# EAGLE design leddriver (EAGLE 9.3.0)
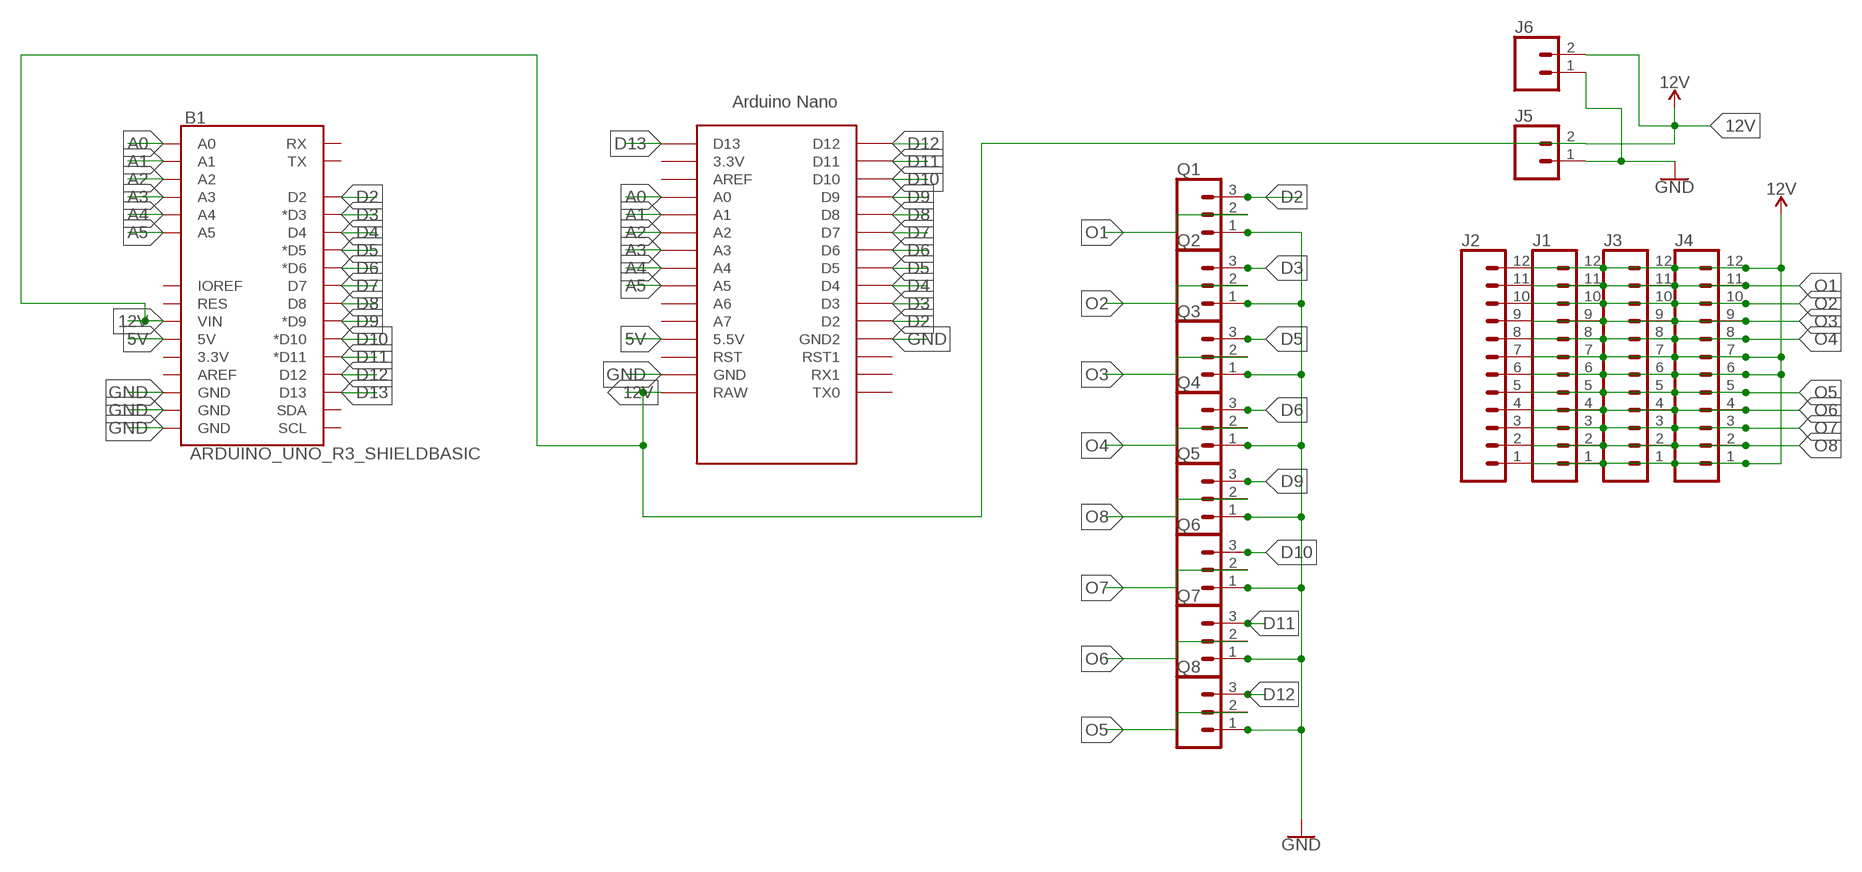
[diagram p0: schematic, sheet 1]

## Parts
B1  ARDUINO_UNO_R3_SHIELDBASIC  [UNO_R3_SHIELD]
J1  CONN_12  [1X12]
J2  CONN_12  [1X12]
J3  CONN_12  [1X12]
J4  CONN_12  [1X12]
J5  CONN_02  [1X02]
J6  CONN_02  [1X02]
Q1  455-1750-1-ND  CONN_03  [1X03]
Q2  455-1750-1-ND  CONN_03  [1X03]
Q3  455-1750-1-ND  CONN_03  [1X03]
Q4  455-1750-1-ND  CONN_03  [1X03]
Q5  455-1750-1-ND  CONN_03  [1X03]
Q6  455-1750-1-ND  CONN_03  [1X03]
Q7  455-1750-1-ND  CONN_03  [1X03]
Q8  455-1750-1-ND  CONN_03  [1X03]
U$1  NANO  [NANO]

## Nets
5V: B1.5V U$1.5V(5.5V)
12V: B1.VIN J1.1 J1.6 J1.7 J1.12 J2.1 J2.6 J2.7 J2.12 J3.1 J3.6 J3.7 J3.12 J4.1 J4.6 J4.7 J4.12 J5.2 J6.2 U$1.RAW
A0: B1.A0 U$1.A0
A1: B1.A1 U$1.A1
A2: B1.A2 U$1.A2
A3: B1.A3 U$1.A3
A4: B1.A4 U$1.A4
A5: B1.A5 U$1.A5
D2: B1.D2 Q1.3 U$1.D2
D3: B1.D3(*D3) Q2.3 U$1.D3
D4: B1.D4 U$1.D4
D5: B1.D5(*D5) Q3.3 U$1.D5
D6: B1.D6(*D6) Q4.3 U$1.D6
D7: B1.D7 U$1.D7
D8: B1.D8 U$1.D8
D9: B1.D9(*D9) Q5.3 U$1.D9
D10: B1.D10(*D10) Q6.3 U$1.D10
D11: B1.D11(*D11) Q7.3 U$1.D11
D12: B1.D12 Q8.3 U$1.D12
D13: B1.D13 U$1.D13
GND: B1.GND@0(GND) B1.GND@1(GND) B1.GND@2(GND) J5.1 J6.1 Q1.1 Q2.1 Q3.1 Q4.1 Q5.1 Q6.1 Q7.1 Q8.1 U$1.GND U$1.GND1(GND2)
O1: J1.11 J2.11 J3.11 J4.11 Q1.2
O2: J1.10 J2.10 J3.10 J4.10 Q2.2
O3: J1.9 J2.9 J3.9 J4.9 Q3.2
O4: J1.8 J2.8 J3.8 J4.8 Q4.2
O5: J1.5 J2.5 J3.5 J4.5 Q8.2
O6: J1.4 J2.4 J3.4 J4.4 Q7.2
O7: J1.3 J2.3 J3.3 J4.3 Q6.2
O8: J1.2 J2.2 J3.2 J4.2 Q5.2
Unconnected: B1.3.3V B1.AREF B1.IOREF B1.RES B1.RX B1.SCL B1.SDA B1.TX U$1.3.3V U$1.A6 U$1.A7 U$1.AREF U$1.ICSP1 U$1.ICSP2 U$1.ICSP3 U$1.ICSP4 U$1.ICSP5 U$1.ICSP6 U$1.RST U$1.RST1 U$1.RX1 U$1.TX0

## Library data of the parts
B1 = SparkFun-Boards:ARDUINO_UNO_R3_SHIELD: Arduino R3 Shield Footprint Shield form compatible with the Arduino Uno R3. SparkFun Products: MG2639 Cellular Shield <https://www.sparkfun.com/products/13120> MIDI Shield <https://www.sparkfun.com/products/12898> R3 Stackable Headers Kit <https://www.sparkfun.com/products/11417>
J1-J4 = SparkFun-Connectors:CONN_12: Multi connection point. Often used as Generic Header-pin footprint for 0.1 inch spaced/style header connections On any of the 0.1 inch spaced packages, you can populate with these: Break Away Headers - Straight <https://www.sparkfun.com/products/116> (PRT-00116) Break Away Male Headers - Right Angle <https://www.sparkfun.com/products/553> (PRT-00553) Female Headers <https://www.sparkfun.com/products/115> (PRT-00115) Break Away Headers - Machine Pin <https://www.sparkfun.com/products/117> (PRT-00117) Break Away Female Headers - Swiss Machine Pin <https://www.sparkfun.com/products/743> (PRT-00743) For SCREWTERMINALS and SPRING TERMINALS visit here: Screw Terimnals on SparkFun.com <https://www.sparkfun.com/search/results?term=Screw+Terminals> (5mm/3.5mm/2.54mm spacing) This device is also useful as a general connection point to wire up your design to another part of your project. Our various solder wires solder well into these plated through hole pads. Hook-Up Wire - Assortment (Stranded, 22 AWG) <https://www.sparkfun.com/products/11375> (PRT-11375) Hook-Up Wire - Assortment (Solid Core, 22 AWG) <https://www.sparkfun.com/products/11367> (PRT-11367) View the entire wire category on our website here <https://www.sparkfun.com/categories/141> Special notes: Molex polarized connector foot print use with SKU : PRT-08231 with associated crimp pins and housings. 1MM SMD Version SKU: PRT-10208 NOTES ON THE VARIANTS LOCK and LOCK_LONGPADS... This footprint was designed to help hold the alignment of a through-hole component (i.e. 6-pin header) while soldering it into place. You may notice that each hole has been shifted either up or down by 0.005 of an inch from it's more standard position (which is a perfectly straight line). This slight alteration caused the pins (the squares in the middle) to touch the edges of the holes. Because they are alternating, it causes a "brace" to hold the component in place. 0.005 has proven to be the perfect amount of "off-center" position when using our standard breakaway headers. Although looks a little odd when you look at the bare footprint, once you have a header in there, the alteration is very hard to notice. Also,if you push a header all the way into place, it is covered up entirely on the bottom side.
J5 J6 = SparkFun-Connectors:CONN_02: Multi connection point. Often used as Generic Header-pin footprint for 0.1 inch spaced/style header connections On any of the 0.1 inch spaced packages, you can populate with these: Break Away Headers - Straight <https://www.sparkfun.com/products/116> (PRT-00116) Break Away Male Headers - Right Angle <https://www.sparkfun.com/products/553> (PRT-00553) Female Headers <https://www.sparkfun.com/products/115> (PRT-00115) Break Away Headers - Machine Pin <https://www.sparkfun.com/products/117> (PRT-00117) Break Away Female Headers - Swiss Machine Pin <https://www.sparkfun.com/products/743> (PRT-00743) For SCREWTERMINALS and SPRING TERMINALS visit here: Screw Terimnals on SparkFun.com <https://www.sparkfun.com/search/results?term=Screw+Terminals> (5mm/3.5mm/2.54mm spacing) This device is also useful as a general connection point to wire up your design to another part of your project. Our various solder wires solder well into these plated through hole pads. Hook-Up Wire - Assortment (Stranded, 22 AWG) <https://www.sparkfun.com/products/11375> (PRT-11375) Hook-Up Wire - Assortment (Solid Core, 22 AWG) <https://www.sparkfun.com/products/11367> (PRT-11367) View the entire wire category on our website here <https://www.sparkfun.com/categories/141> Special notes: Molex polarized connector foot print use with: PRT-08233 with associated crimp pins and housings. 2.54_SCREWTERM for use with PRT-10571. 3.5mm Screw Terminal footprints for PRT-08084 5mm Screw Terminal footprints for use with PRT-08432
Q1-Q8 = SparkFun-Connectors:CONN_03: Multi connection point. Often used as Generic Header-pin footprint for 0.1 inch spaced/style header connections On any of the 0.1 inch spaced packages, you can populate with these: Break Away Headers - Straight <https://www.sparkfun.com/products/116> (PRT-00116) Break Away Male Headers - Right Angle <https://www.sparkfun.com/products/553> (PRT-00553) Female Headers <https://www.sparkfun.com/products/115> (PRT-00115) Break Away Headers - Machine Pin <https://www.sparkfun.com/products/117> (PRT-00117) Break Away Female Headers - Swiss Machine Pin <https://www.sparkfun.com/products/743> (PRT-00743) Stackable Header - 3 Pin (Female, 0.1") <https://www.sparkfun.com/products/13875> (PRT-13875) For SCREWTERMINALS and SPRING TERMINALS visit here: Screw Terimnals on SparkFun.com <https://www.sparkfun.com/search/results?term=Screw+Terminals> (5mm/3.5mm/2.54mm spacing) This device is also useful as a general connection point to wire up your design to another part of your project. Our various solder wires solder well into these plated through hole pads. Hook-Up Wire - Assortment (Stranded, 22 AWG) <https://www.sparkfun.com/products/11375> (PRT-11375) Hook-Up Wire - Assortment (Solid Core, 22 AWG) <https://www.sparkfun.com/products/11367> (PRT-11367) View the entire wire category on our website here <https://www.sparkfun.com/categories/141> Special notes: Molex polarized connector foot print use with SKU : PRT-08232 with associated crimp pins and housings.; PROD_ID: XXX-00000
U$1 = Arduino-clone:NANO: Arduino Nano

## Board
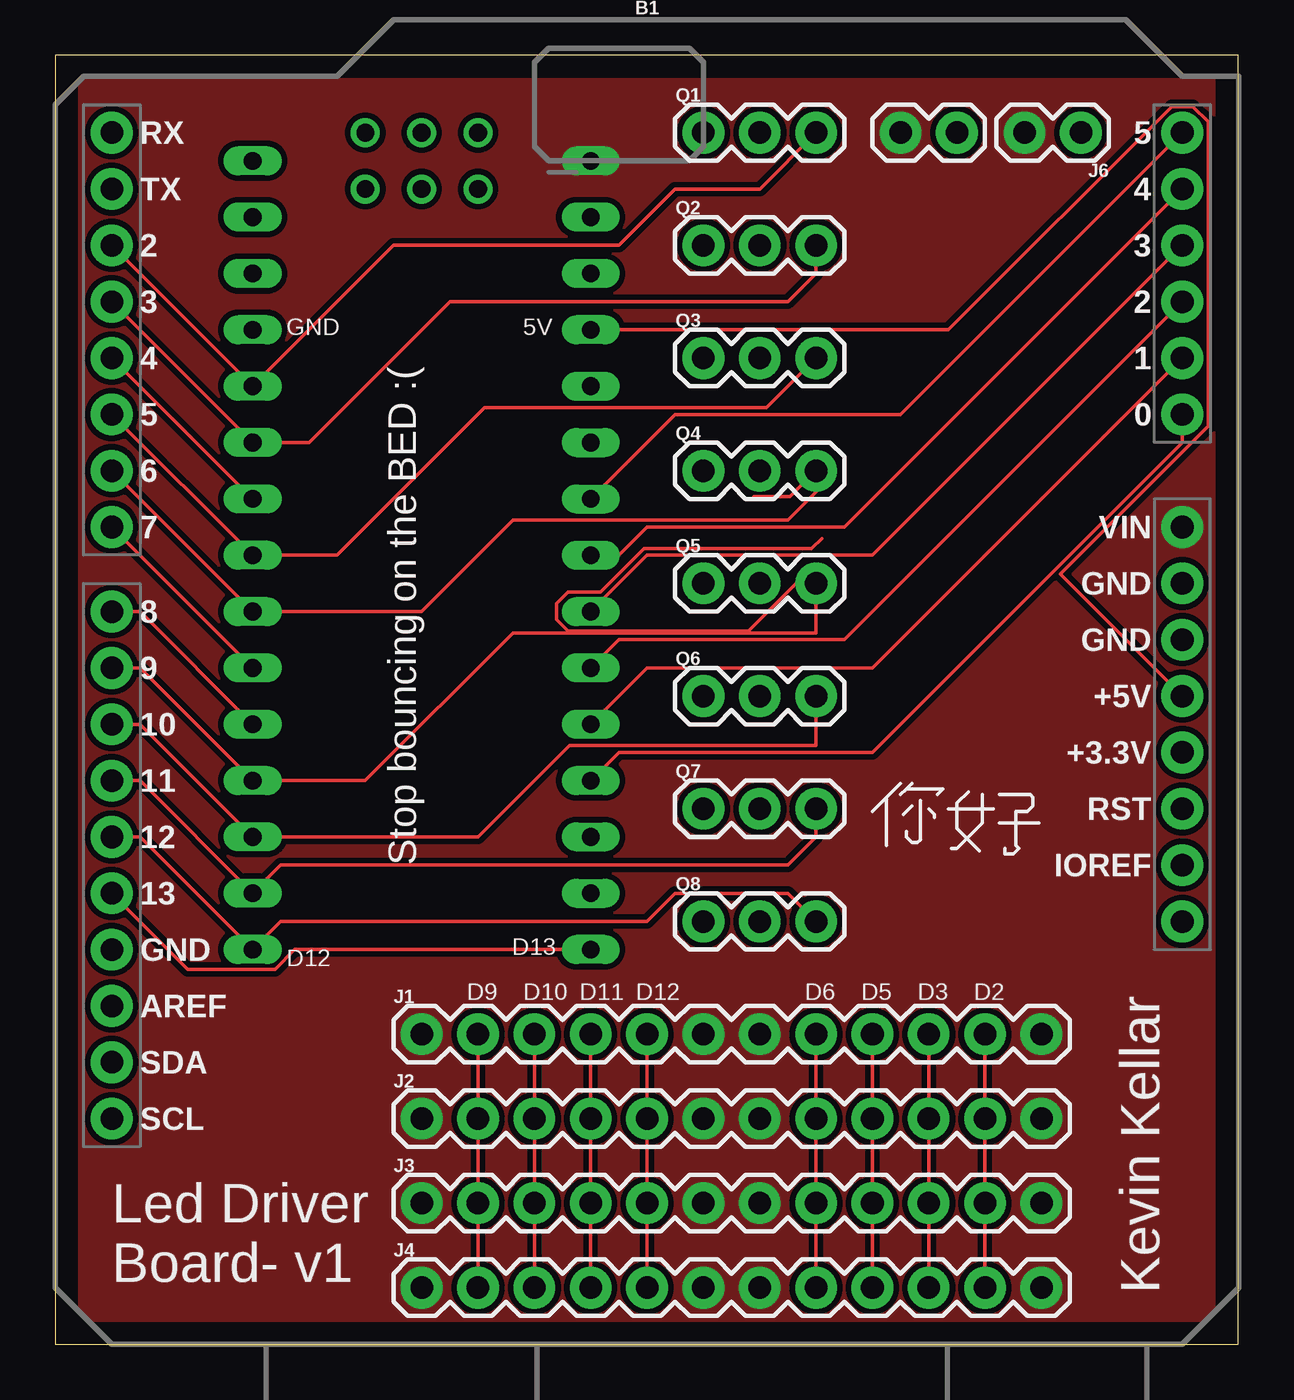
[diagram p1: board, top side]
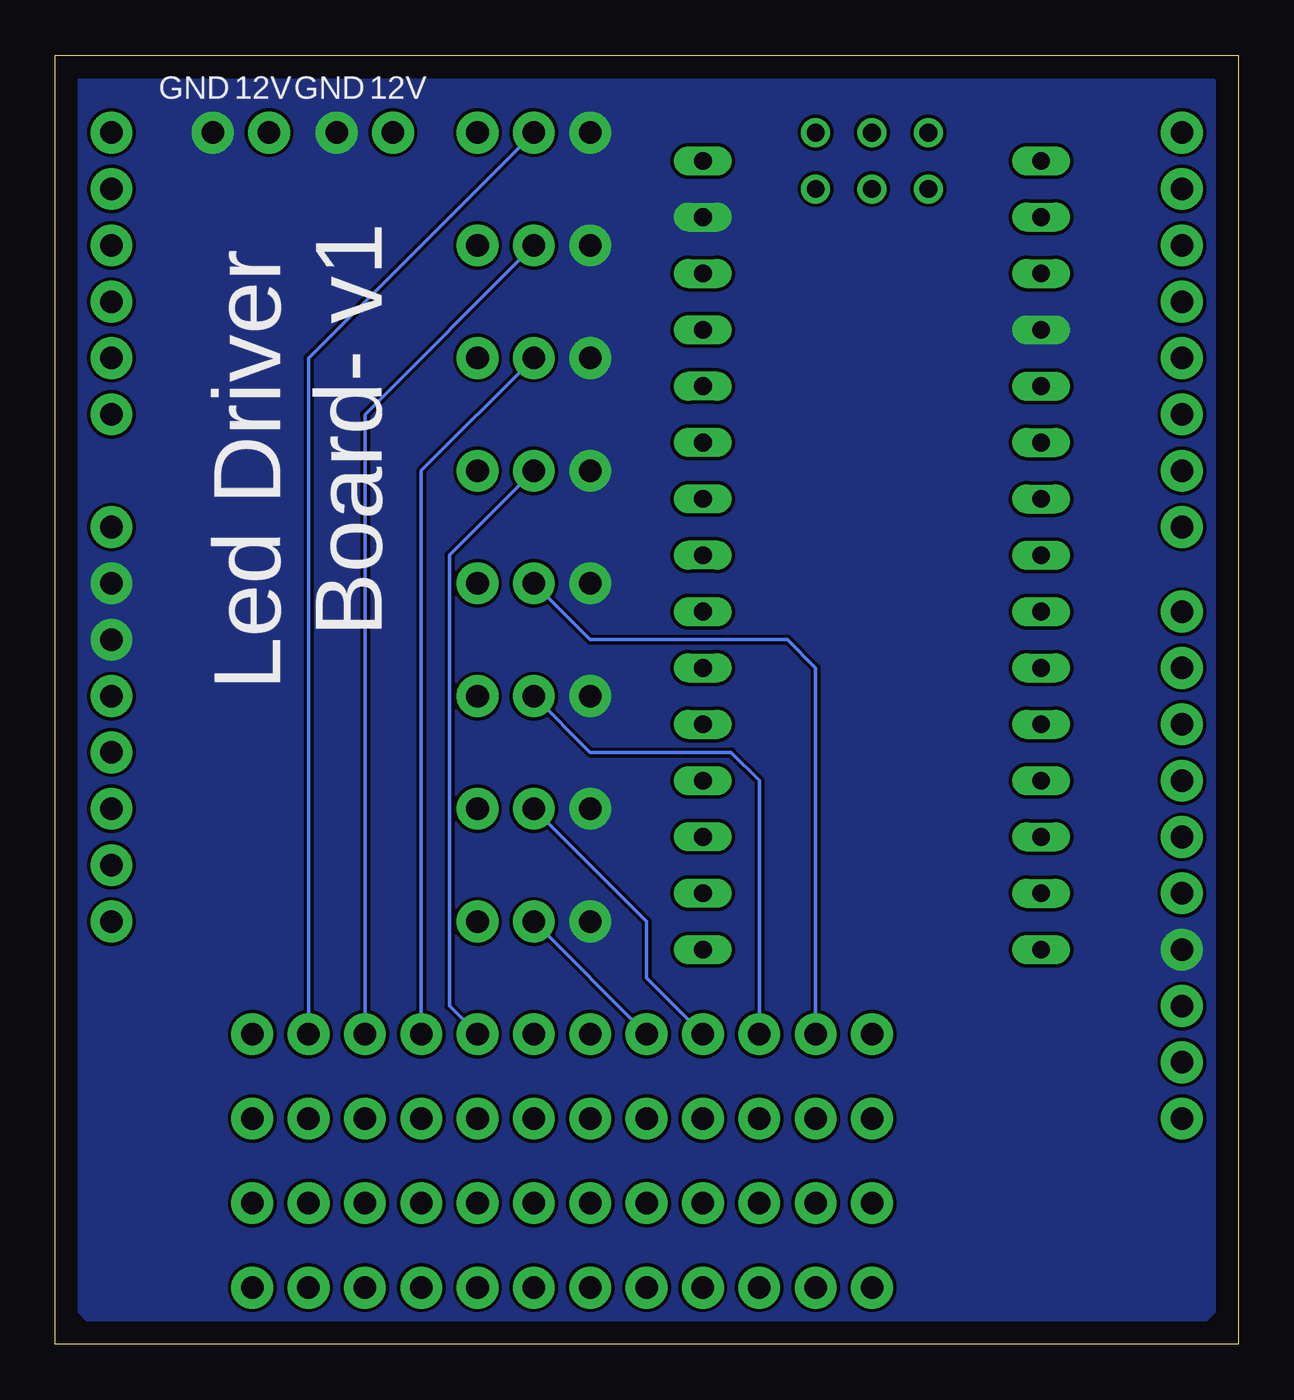
[diagram p2: board, bottom side, seen from below]

Size 53.32 x 58.09 mm. Coordinates in mm from the lower left corner, seen from the top.
Outline: 0,0 53.32,0 53.32,58.09 0,58.09 0,0
Copper layers (1*16): Top 0.035mm / dielectric 1.5mm / Bottom 0.035mm
Design rules "default": minimum track width 6mil, minimum drill 0.35mm, track to track 6mil, track to pad 6mil, pad to pad 6mil, via to via 6mil, smd to smd 6mil, copper to edge 40mil, drill to drill 6mil, minimum pad ring 10mil, minimum via ring 8mil, stop-mask expansion 4mil, vias tented up to drill 0mil, thermal gap 10mil

### Footprints (pad centres in the part's own frame; a part is rotated, then mirrored left to right if it is on the bottom)
UNO_R3_SHIELD = drill 1.016 pad 1.88: 3.3V 24.13,-2.54; 5V 24.13,0; A0 24.13,12.7; A1 24.13,15.24; A2 24.13,17.78; A3 24.13,20.32; A4 24.13,22.86; A5 24.13,25.4; AREF -24.13,-13.97; D2 -24.13,20.32; D3 -24.13,17.78; D4 -24.13,15.24; D5 -24.13,12.7; D6 -24.13,10.16; D7 -24.13,7.62; D8 -24.13,3.81; D9 -24.13,1.27; D10 -24.13,-1.27; D11 -24.13,-3.81; D12 -24.13,-6.35; D13 -24.13,-8.89; GND@0 24.13,2.54; GND@1 24.13,5.08; GND@2 -24.13,-11.43; IOREF 24.13,-7.62; NC 24.13,-10.16; RES 24.13,-5.08; RX -24.13,25.4; SCL -24.13,-19.05; SDA -24.13,-16.51; TX -24.13,22.86; VIN 24.13,7.62
1X12 = drill 1.016 pad 1.88: 1 0,0; 2 2.54,0; 3 5.08,0; 4 7.62,0; 5 10.16,0; 6 12.7,0; 7 15.24,0; 8 17.78,0; 9 20.32,0; 10 22.86,0; 11 25.4,0; 12 27.94,0
1X02 = drill 1.016 pad 1.88: 1 0,0; 2 2.54,0
1X03 = drill 1.016 pad 1.88: 1 0,0; 2 2.54,0; 3 5.08,0
NANO = drill 0.8 long: 3.3V -10.16,24.13; 5V -10.16,-1.27; A0 -10.16,19.05; A1 -10.16,16.51; A2 -10.16,13.97; A3 -10.16,11.43; A4 -10.16,8.89; A5 -10.16,6.35; A6 -10.16,3.81; A7 -10.16,1.27; AREF -10.16,21.59; D2 5.08,1.27; D3 5.08,3.81; D4 5.08,6.35; D5 5.08,8.89; D6 5.08,11.43; D7 5.08,13.97; D8 5.08,16.51; D9 5.08,19.05; D10 5.08,21.59; D11 5.08,24.13; D12 5.08,26.67; D13 -10.16,26.67; GND -10.16,-6.35; GND1 5.08,-1.27; RAW -10.16,-8.89; RST -10.16,-3.81; RST1 5.08,-3.81; RX1 5.08,-6.35; TX0 5.08,-8.89 | drill 0.8: ICSP1 -5.08,-10.16; ICSP2 -5.08,-7.62; ICSP3 -2.54,-10.16; ICSP4 -2.54,-7.62; ICSP5 0,-10.16; ICSP6 0,-7.62

### Placement (x,y rotation side)
B1  26.67,29.21 0 top
J1  16.51,13.97 0 top
J2  16.51,10.16 0 top
J3  16.51,6.35 0 top
J4  16.51,2.54 0 top
J5  40.64,54.61 180 top
J6  46.23,54.61 180 top
Q1  29.21,54.61 0 top
Q2  29.21,49.53 0 top
Q3  29.21,44.45 0 top
Q4  29.21,39.37 0 top
Q5  29.21,34.29 0 top
Q6  29.21,29.21 0 top
Q7  29.21,24.13 0 top
Q8  29.21,19.05 0 top
U$1  13.97,44.45 180 top

### Tracks (layer width: path | path; a pad name or v marks a point on that pad's centre or on a via)
5V
  Top 0.152: B1.5V 45.3,34.71 51.97,41.38 51.97,55.09 51.28,55.78 50.32,55.78 40.26,45.72 U$1.5V
12V
  pour Top (isolate 0.254, no thermals): 0,55.88 1.27,57.15 53.34,57.15 53.34,2.54 50.8,0 2.54,0 0,2.54
A0
  Top 0.152: U$1.A0 25.4,26.67 36.83,26.67 50.8,40.64 B1.A0
A1
  Top 0.152: U$1.A1 26.67,30.48 36.83,30.48 B1.A1
A2
  Top 0.152: U$1.A2 25.4,31.75 35.56,31.75 B1.A2
A3
  Top 0.152: U$1.A3 26.67,35.56 36.83,35.56 B1.A3
A4
  Top 0.152: U$1.A4 25.4,35.56 26.67,36.83 35.56,36.83 B1.A4
A5
  Top 0.152: U$1.A5 27.94,41.91 38.1,41.91 B1.A5
D2
  Top 0.152: B1.D2 U$1.D2 15.24,49.53 25.4,49.53 27.94,52.07 31.75,52.07 Q1.3
D3
  Top 0.152: B1.D3 U$1.D3 11.43,40.64 17.78,46.99 33.02,46.99 34.29,48.26 Q2.3
D4
  Top 0.152: U$1.D4 B1.D4
D5
  Top 0.152: B1.D5 U$1.D5 12.7,35.56 19.35,42.22 32.05,42.22 Q3.3
D6
  Top 0.152: B1.D6 U$1.D6 16.51,33.02 20.62,37.14 33.02,37.14 34.29,38.41 Q4.3 33.12,38.2 31.5,38.2
D7
  Top 0.152: U$1.D7 B1.D7
D8
  Top 0.152: U$1.D8 3.81,33.02 B1.D8
D9
  Top 0.152: B1.D9 3.81,30.48 U$1.D9 13.97,25.4 20.62,32.06 34.29,32.06 Q5.3 34.54,34.54 33.66,34.54 31.25,32.14 23.11,32.14 22.59,32.65 22.59,33.39 23.11,33.9 24.58,33.9 26.54,35.86 34.09,35.86 34.54,36.32
D10
  Top 0.152: B1.D10 3.81,27.94 U$1.D10 19.05,22.86 23.16,26.97 34.29,26.97 Q6.3
D11
  Top 0.152: B1.D11 3.81,25.4 U$1.D11 10.16,21.59 33.02,21.59 34.29,22.86 Q7.3
D12
  Top 0.152: B1.D12 3.81,22.86 U$1.D12 10.16,19.05 26.67,19.05 27.94,20.32 33.02,20.32 Q8.3
D13
  Top 0.152: U$1.D13 10.79,17.78 9.91,16.9 5.96,16.9 B1.D13
GND
  pour Bottom (no thermals): 0,55.88 1.27,57.15 12.7,57.15 50.8,57.15 53.34,57.15 53.34,2.54 50.8,0 2.54,0 0,2.54
O1
  Top 0.152: J4.11 J3.11 J2.11 J1.11
  Bottom 0.152: Q1.2 41.91,44.45 J1.11
O2
  Top 0.152: J1.10 J2.10 J3.10 J4.10
  Bottom 0.152: Q2.2 39.37,41.91 J1.10
O3
  Top 0.152: J4.9 J3.9 J2.9 J1.9
  Bottom 0.152: Q3.2 36.83,39.37 J1.9
O4
  Top 0.152: J1.8 J2.8 J3.8 J4.8
  Bottom 0.152: Q4.2 35.56,35.56 35.56,15.24 J1.8
O5
  Top 0.152: J4.5 J3.5 J2.5 J1.5
  Bottom 0.152: Q8.2 J1.5
O6
  Top 0.152: J1.4 J2.4 J3.4 J4.4
  Bottom 0.152: Q7.2 26.67,19.05 26.67,16.51 J1.4
O7
  Top 0.152: J1.3 J2.3 J3.3 J4.3
  Bottom 0.152: Q6.2 29.21,26.67 22.86,26.67 21.59,25.4 J1.3
O8
  Top 0.152: J1.2 J2.2 J3.2 J4.2
  Bottom 0.152: Q5.2 29.21,31.75 20.32,31.75 19.05,30.48 J1.2

### Text on the board
tPlace: Stop bouncing on the BED :( | Led Driver / Board- v1 | Kevin Kellar
bPlace: Led Driver / Board- v1
tNames: GND | 5V | D12 | D13 | D9 | D10 | D11 | D12 | D6 | D5 | D3 | D2
bNames: 12V | GND | 12V | GND